# Altium project robotShield.PrjPcb
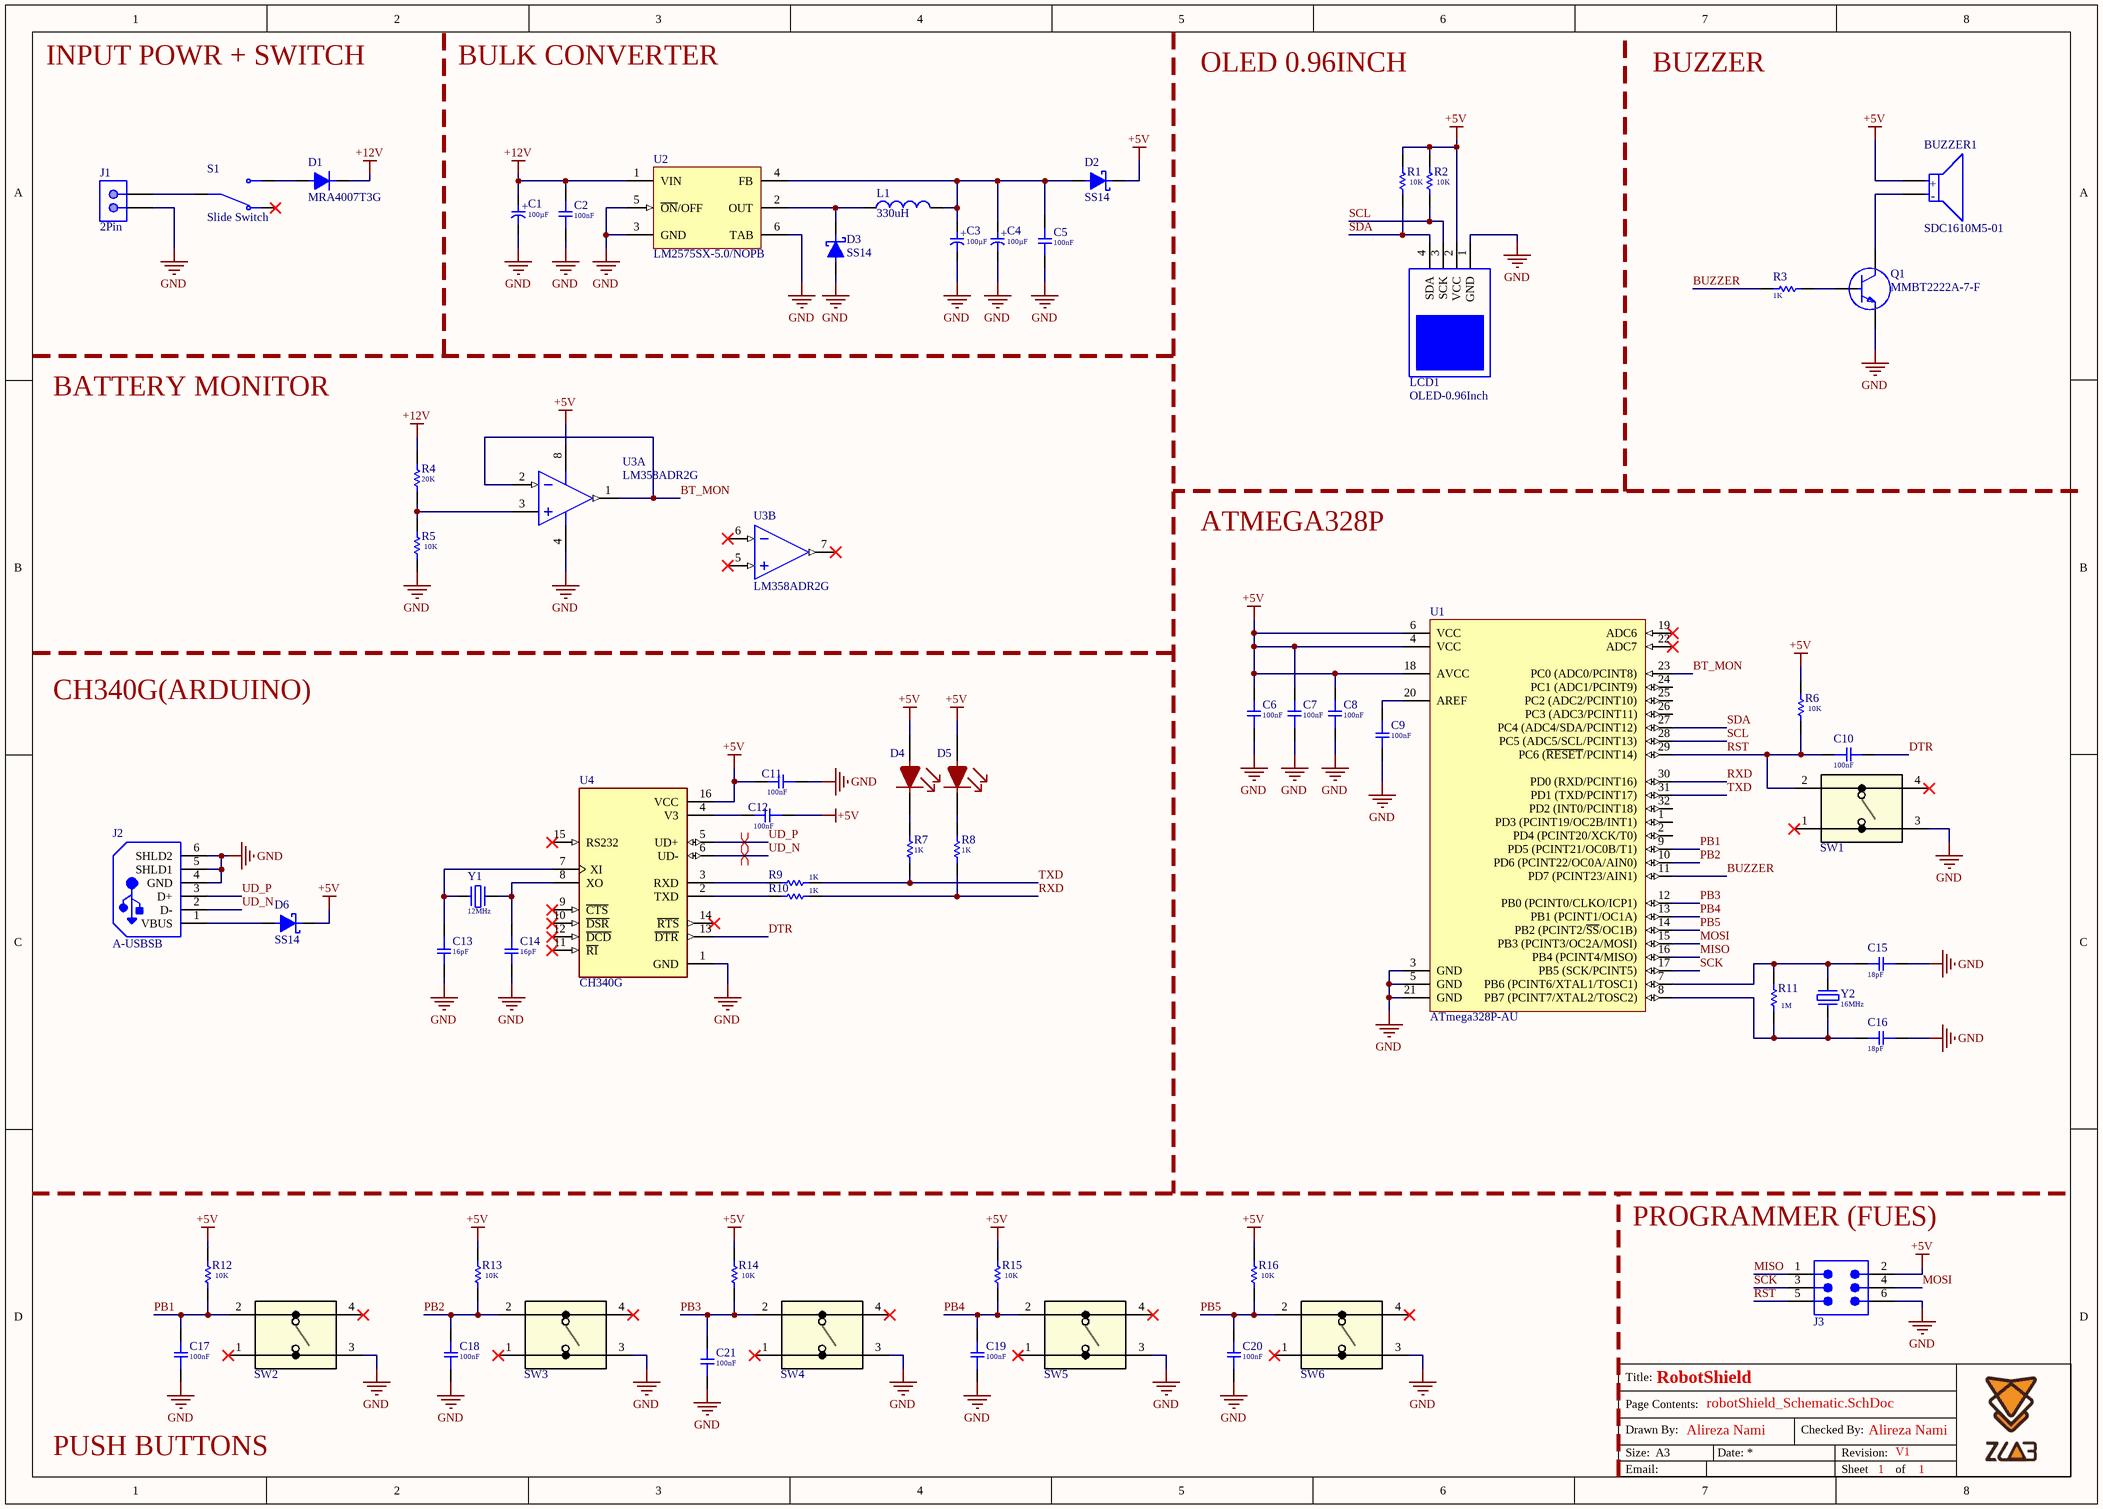
[diagram p0: robotShield_Schematic.SchDoc]
Project: RobotShield
1 sheet, 63 parts. Net scope: global (net labels, ports and power ports of the same name join across sheets).
Board file: robotShield_PCB.PcbDoc

## Sheet robotShield_Schematic.SchDoc
size A3; CheckedBy: Alireza Nami; DrawnBy: Alireza Nami; SheetNumber: 1; SheetTotal: 1; TotalSheet: 1; VersionRevision: V1

### Parts
BUZZER1  SDC1610M5-01  [BUZZER]
C1  Capacitance: 100µF  [CE-8x10mm]  (hidden comment: MAL215376101E3)
C2  Capacitance: 100nF  [C0603]  (hidden comment: CGA3E2X7R1H104K080AA)
C3  Capacitance: 100µF  [CE-8x10mm]  (hidden comment: MAL215376101E3)
C4  Capacitance: 100µF  [CE-8x10mm]  (hidden comment: MAL215376101E3)
C5  Capacitance: 100nF  [C0603]  (hidden comment: CGA3E2X7R1H104K080AA)
C6  Capacitance: 100nF  [C0603]  (hidden comment: CGA3E2X7R1H104K080AA)
C7  Capacitance: 100nF  [C0603]  (hidden comment: CGA3E2X7R1H104K080AA)
C8  Capacitance: 100nF  [C0603]  (hidden comment: CGA3E2X7R1H104K080AA)
C9  Capacitance: 100nF  [C0603]  (hidden comment: CGA3E2X7R1H104K080AA)
C10  Capacitance: 100nF  [C0603]  (hidden comment: CGA3E2X7R1H104K080AA)
C11  Capacitance: 100nF  [C0603]  (hidden comment: CGA3E2X7R1H104K080AA)
C12  Capacitance: 100nF  [C0603]  (hidden comment: CGA3E2X7R1H104K080AA)
C13  value 16pF  [C0603]  (hidden comment: C0603C160J3GACTU)
C14  value 16pF  [C0603]  (hidden comment: C0603C160J3GACTU)
C15  value 18pF  [C0603]  (hidden comment: C0603C180J3GACTU)
C16  value 18pF  [C0603]  (hidden comment: C0603C180J3GACTU)
C17  Capacitance: 100nF  [C0603]  (hidden comment: CGA3E2X7R1H104K080AA)
C18  Capacitance: 100nF  [C0603]  (hidden comment: CGA3E2X7R1H104K080AA)
C19  Capacitance: 100nF  [C0603]  (hidden comment: CGA3E2X7R1H104K080AA)
C20  Capacitance: 100nF  [C0603]  (hidden comment: CGA3E2X7R1H104K080AA)
C21  Capacitance: 100nF  [C0603]  (hidden comment: CGA3E2X7R1H104K080AA)
D1  MRA4007T3G  [SMA]
D2  SS14  [SMA]
D3  SS14  [SMA]
D4  SML-D12U1WT86  [LED_RED_0603]  (value not drawn)
D5  SML-D12U1WT86  [LED_RED_0603]  (value not drawn)
D6  SS14  [SMA]
J1  2Pin  [MOLX-2P-2.54MM]
J2  A-USBSB  [USBS-B]
J3  61200621621  [ICSP]  (value not drawn)
L1  value 330uH  [WE-PD_7332R]  (hidden comment: SRR0745A-331M)
LCD1  OLED-0.96Inch  [OLED]
Q1  MMBT2222A-7-F  [SOT23]
R1  value 10K  [R0603]  (hidden comment: RC0603JR-0710KL)
R2  value 10K  [R0603]  (hidden comment: RC0603JR-0710KL)
R3  Resistance: 1K  [R0603]  (hidden comment: RC0603JR-071KL)
R4  value 20K  [R0603]  (hidden comment: RC0603JR-0720KL)
R5  value 10K  [R0603]  (hidden comment: RC0603JR-0710KL)
R6  value 10K  [R0603]  (hidden comment: RC0603JR-0710KL)
R7  Resistance: 1K  [R0603]  (hidden comment: RC0603JR-071KL)
R8  Resistance: 1K  [R0603]  (hidden comment: RC0603JR-071KL)
R9  Resistance: 1K  [R0603]  (hidden comment: RC0603JR-071KL)
R10  Resistance: 1K  [R0603]  (hidden comment: RC0603JR-071KL)
R11  value 1M  [R0603]  (hidden comment: RC0603JR-071ML)
R12  value 10K  [R0603]  (hidden comment: RC0603JR-0710KL)
R13  value 10K  [R0603]  (hidden comment: RC0603JR-0710KL)
R14  value 10K  [R0603]  (hidden comment: RC0603JR-0710KL)
R15  value 10K  [R0603]  (hidden comment: RC0603JR-0710KL)
R16  value 10K  [R0603]  (hidden comment: RC0603JR-0710KL)
S1  Slide Switch  [SLIDE_SWITCH_RIGHT]
SW1  222AMVBAR  [TS_6x6x5]  (value not drawn)
SW2  222AMVBAR  [TS_6x6x5]  (value not drawn)
SW3  222AMVBAR  [TS_6x6x5]  (value not drawn)
SW4  222AMVBAR  [TS_6x6x5]  (value not drawn)
SW5  222AMVBAR  [TS_6x6x5]  (value not drawn)
SW6  222AMVBAR  [TS_6x6x5]  (value not drawn)
U1  ATmega328P-AU  [TQFP32]
U2  LM2575SX-5.0/NOPB  [DPAK-5]
U3  LM358ADR2G  [SOIC-8]  (parts A,B of 2)
U4  CH340G  [SOIC-16]
Y1  Frequency: 12MHz  [XTAL-SMD]  (hidden comment: LFXTAL003210BULK)
Y2  Frequency: 16MHz  [XTAL-SMD]  (hidden comment: ABLS-16.000MHZ-K4T)

### Nets
+5V: BUZZER1.2(A) C6.1 C7.1 C8.1 C11.1 C12.2 D2.1(C) D4.2(A) D5.2(A) D6.1(C) J3.2 LCD1.2(VCC) R1.2 R2.2 R6.2 R12.2 R13.2 R14.2 R15.2 R16.2 U1.4(VCC) U1.6(VCC) U1.18(AVCC) U3.8 U4.16(VCC)
+12V: C1.2(A) C2.1 D1.1(K) R4.2 U2.1(VIN)
GND: C1.1(C) C2.2 C3.1(C) C4.1(C) C5.2 C6.2 C7.2 C8.2 C9.1 C11.2 C13.1 C14.1 C15.2 C16.2 C17.2 C18.2 C19.2 C20.2 C21.2 D3.2(A) J1.1 J2.4(GND) J2.5(SHLD1) J2.6(SHLD2) J3.6 LCD1.1(GND) Q1.2(E) R5.1 SW1.3 SW2.3 SW3.3 SW4.3 SW5.3 SW6.3 U1.3(GND) U1.5(GND) U1.21(GND) U2.3(GND) U2.5(~{ON}/OFF) U2.6(TAB) U3.4 U4.1(GND)
BT_MON: U1.23(PC0_(ADC0/PCINT8)) U3.1(OUTA) U3.2(INA-)
BUZZER: R3.2 U1.11(PD7_(PCINT23/AIN1))
DTR: C10.1 U4.13(~{DTR})
MISO: J3.1 U1.16(PB4_(PCINT4/MISO))
MOSI: J3.4 U1.15(PB3_(PCINT3/OC2A/MOSI))
PB1: C17.1 R12.1 SW2.2 U1.9(PD5_(PCINT21/OC0B/T1))
PB2: C18.1 R13.1 SW3.2 U1.10(PD6_(PCINT22/OC0A/AIN0))
PB3: C21.1 R14.1 SW4.2 U1.12(PB0_(PCINT0/CLKO/ICP1))
PB4: C19.1 R15.1 SW5.2 U1.13(PB1_(PCINT1/OC1A))
PB5: C20.1 R16.1 SW6.2 U1.14(PB2_(PCINT2/~{SS}/OC1B))
RST: C10.2 J3.5 R6.1 SW1.2 U1.29(PC6_(~{RESET}/PCINT14))
RXD: R8.1 R10.2 U1.30(PD0_(RXD/PCINT16))
SCK: J3.3 U1.17(PB5_(SCK/PCINT5))
SCL: LCD1.3(SCK) R2.1 U1.28(PC5_(ADC5/SCL/PCINT13))
SDA: LCD1.4(SDA) R1.1 U1.27(PC4_(ADC4/SDA/PCINT12))
TXD: R7.1 R9.2 U1.31(PD1_(TXD/PCINT17))
UD_N: J2.2(D-) U4.6(UD-)
UD_P: J2.3(D+) U4.5(UD+)
NetBUZZER1_1: BUZZER1.1(C) Q1.3(C)
NetC3_2: C3.2(A) C4.2(A) C5.1 D2.2(A) L1.2 U2.4(FB)
NetC9_2: C9.2 U1.20(AREF)
NetC12_1: C12.1 U4.4(V3)
NetC13_2: C13.2 U4.7(XI) Y1.1
NetC14_2: C14.2 U4.8(XO) Y1.2
NetC15_1: C15.1 R11.2 U1.7(PB6_(PCINT6/XTAL1/TOSC1)) Y2.2
NetC16_1: C16.1 R11.1 U1.8(PB7_(PCINT7/XTAL2/TOSC2)) Y2.1
NetD1_2: D1.2(A) S1.3
NetD3_1: D3.1(C) L1.1 U2.2(OUT)
NetD4_1: D4.1(C) R7.2
NetD5_1: D5.1(C) R8.2
NetD6_2: D6.2(A) J2.1(VBUS)
NetJ1_2: J1.2 S1.2
NetQ1_1: Q1.1(B) R3.1
NetR4_1: R4.1 R5.2 U3.3(INA+)
NetR9_1: R9.1 U4.3(RXD)
NetR10_1: R10.1 U4.2(TXD)

Not connected (* = marked no-connect by the designer): S1 1*; SW1 1* 4*; SW2 1* 4*; SW3 1* 4*; SW4 1* 4*; SW5 1* 4*; SW6 1* 4*; U1 1(PD3_(PCINT19/OC2B/INT1)) 2(PD4_(PCINT20/XCK/T0)) 19(ADC6)* 22(ADC7)* 24(PC1_(ADC1/PCINT9)) 25(PC2_(ADC2/PCINT10)) 26(PC3_(ADC3/PCINT11)) 32(PD2_(INT0/PCINT18)); U3 5(INB+)* 6(INB-)* 7(OUTB)*; U4 9(~{CTS})* 10(~{DSR})* 11(~{RI})* 12(~{DCD})* 14(~{RTS})* 15(RS232)*

### Layout directives
differential pair: UD_N, UD_P

### Notes on the sheet
- INPUT POWR + SWITCH
- BULK CONVERTER
- OLED 0.96INCH
- BUZZER
- BATTERY MONITOR
- ATMEGA328P
- CH340G(ARDUINO)
- (near J3) PROGRAMMER (FUES)
- PUSH BUTTONS
- Title:
- Size:
- Drawn By:
- Email:
- Page Contents:
- A3
- Date:
- Checked By:
- Revision:
- Sheet
- of
- (in symbol BUZZER-5V) +; -
- (in symbol CE-100uF-25V) +

### Library data of the parts
BUZZER1 = BUZZER-5V: AUDIO MAGNETIC INDICATOR 4-8V TH; Nominal Supply Voltage (DC): 5V; Input Type: DC; Max Supply Current: 30mA; Number of Terminals/Pins: 2; Frequency: 2.4kHz; Lead Free: Lead Free; Operating Supply Current: 30mA; Sensing Method: Magnetic; Termination: PC Pins; Number of Pins: 2; Mount: Through Hole; Min Operating Temperature: -10°C; Diameter: 16mm; Series: SDC; Max Operating Temperature: 70°C; Packaging: Tray; Voltage Rating: 5V; Height: 10mm
C1 C3 C4 = CE-100uF-25V: MAL215376101E3 Cap Aluminum 100uF 25V 20% (8 X 10mm) SMD 0.5 Ohm 180mA 3000h 105C Blister T/R; NexarPartId: 42636023; Polarity: Polar; Dissipation Factor: 16%; Dielectric Material: Aluminium; Life (Hours): 2000hours; ESR (Equivalent Series Resistance): 500mΩ; Leakage Current: 22µA; Mount: Surface Mount; Voltage: 25V; Min Operating Temperature: -55°C; Max Operating Temperature: 105°C; Termination: SMD/SMT; Diameter: 8mm; Tolerance: 20%; Lead Free: Lead Free; Ripple Current (AC): 180mA; Ripple Current: 180mA; Height - Seated (Max): 10.4902mm; Voltage Rating: 25V; REACH SVHC: Unknown; Number of Pins: 2; Width: 8.6mm; Radiation Hardening: No; Height: 10mm; Voltage Rating (AC): 25V; Voltage Rating (DC): 25V; Case/Package: Radial; Schedule B: 8532220020, 8532220020|8532220020, 8532220020|8532220020|8532220020, 8532220020|8532220020|8532220020|8532220020; RoHS: Compliant; Packaging: Cut Tape
C2 C5-C12 C17-C21 = 100N-50V-X7R-0603: Cap Ceramic 100nF 50V X7R 10% Pad SMD 0603 +125°C Automotive T/R; Weight: 7.1E-05oz; Composition: Ceramic; Max Operating Temperature: 125°C; Termination: SMD/SMT; Dielectric: X7R; Length: 1.6mm; Package Quantity: 1; REACH SVHC: No SVHC; Lead Free: Lead Free; Case Code (Metric): 1608; Min Operating Temperature: -55°C; Packaging: Tape and Reel; Tolerance: 10%; Voltage Rating: 50V; Case Code (Imperial): 0603; Case/Package: 0603; Voltage Rating (DC): 50V; Depth: 0.8mm; Radiation Hardening: No; Ratings: AEC-Q200; Mount: Surface Mount; Voltage: 50V; Thickness: 0.035inch; Width: 0.8mm; Height: 0.8mm
C13 C14 = 16P-25V-C0G-0603: 16 pF ±5% 25V Ceramic Capacitor C0G, NP0 0603 (1608 Metric); Manufacturer: KEMET; Supplier: Digikey; Supplier Part Number: 399-C0603C160J3GACTUTR-ND; Manufacturer Part Number: C0603C160J3GACTU; RoHS: No; Pricing: 4000=0.05638 (USD)
C15 C16 = 18P-25V-C0G-0603: 0603 (1608METRIC) Ceramic Capacitor SMD Comm C0G 25V 18PF ±5% C0G NP0; Manufacturer: KEMET; Temperature Coefficient: 30ppm/°C; Supplier Part Number: 80-C0603C180J3G; Manufacturer Part Number: C0603C180J3GACTU; RoHS: Yes; Category: Ceramic Capacitors; Stock: 8329; Pricing: 1=0.23, 10=0.131, 50=0.131, 100=0.078, 1000=0.053, 10000=0.039 (USD); Mounting Technology: Surface Mount; Case/Package: 0603; Case Code (Imperial): 0603; Case Code (Metric): 1608; Dielectric Material: Ceramic; Material: Ceramic; Min Operating Temperature: -55°C; Max Operating Temperature: 125°C; Tolerance: 5%; Voltage Rating: 25V; Packaging: Tape and Reel; Package Quantity: 4000; Voltage Rating (DC): 25V; Dielectric: C0G; Termination: SMD/SMT; Series: C; Construction: Flat; Length: 1.6mm; Width: 0.031inch; Height: 0.8mm; Lead Pitch: 0.7mm; Thickness: 0.034inch; Depth: 0.8mm; Radiation Hardening: No; Reach SVHC Compliant: No; Lead Free: Lead Free; RoHS Compliant: Yes; ComponentLink1URL: https://datasheet.ciiva.com/23984/1723858-23984097.pdf?src-supplier=Newark; ComponentLink1Description: https://datasheet.ciiva.com/23984/1723858-23984097.pdf?src-supplier=Newark; ComponentLink2URL: https://datasheet.ciiva.com/22752/1907778-22752151.pdf?src-supplier=Element14; ComponentLink2Description: https://datasheet.ciiva.com/22752/1907778-22752151.pdf?src-supplier=Element14; ComponentLink3URL: https://datasheet.ciiva.com/28453/1907778-28453241.pdf?src-supplier=Element14; ComponentLink3Description: https://datasheet.ciiva.com/28453/1907778-28453241.pdf?src-supplier=Element14; ComponentLink4URL: https://datasheet.ciiva.com/5421/kem-c1003-c0g-smd-5421693.pdf?src-supplier=Mouser; ComponentLink4Description: https://datasheet.ciiva.com/5421/kem-c1003-c0g-smd-5421693.pdf?src-supplier=Mouser; Supplier: Mouser
D1 = M7: Surface Mount Standard Recovery Power Rectifier, 2-Pin SMA, Pb-Free, Tape and Reel; Manufacturer: On Semiconductor; IFSM Max (A): 30; IO(rec) Max (A): 1; VRRM Max (V): 1000; RoHS: TRUE; PackageReference: SMA-2-403D-02; ComponentLink2Description: Datasheet; PackageVersion: Rev. G, 07/2012; Packing: Tape and Reel; ComponentLink3Description: Package Specification; DatasheetVersion: Rev. 9; Type: Standard Recovery; ComponentLink1Description: Manufacturer URL; PackageDescription: 2-Pin Small Molded Package, J-Bend Lead, Body 2.605 x 4.315 mm; PartNumber: MRA4007T3G; ComponentLink3URL: http://www.onsemi.com/pub_link/Collateral/403D-02.PDF; ComponentLink2URL: http://www.onsemi.com/pub_link/Collateral/MRA4003T3-D.PDF; ComponentLink1URL: http://www.onsemi.com/; Mounting Technology: Surface Mount
D2 D3 D6 = SS14: DIODE SCHOTTKY 40V 1A DO214AC; Manufacturer: Vishay; Manufacturer Part Number: SS14-E3/61T; Peak Reverse Current: 0.2mA; Standoff Height: 0mm; Max Junction Temp: +150°C; Max Surge Forward Current: 40A; RoHS: TRUE; Digikey Description: DIODE SCHOTTKY 40V 1A DO214AC; Category: Diode; Device Class L3: Schottky Diodes; Temperature Range High: +150°C; Automotive: No; Temperature: -65°C to +150°C; Device Class L2: Diodes; Forward Current: 1A; Temperature Range Low: -65°C; Footprint Url: http://www.vishay.com/docs/95400/sma.pdf; Octopart: https://octopart.com/ss14-e3%2F61t-vishay-39552847; Package: 95400; Max Repetitive Reverse Voltage: 40V; ComponentLink2Description: Datasheet; ComponentLink2URL: http://www.vishay.com/docs/88746/ss12.pdf; Lead Free: Yes; Height: 2.29mm; Mouser Description: SS14 Series 40 V 1 A Surface Mount Schottky Barrier Rectifier - DO-214AC (SMA); Device Class L1: Discrete Semiconductors
D4 D5 = LED_RED_0603: LED RED DIFFUSED 1608 SMD; Manufacturer: Rohm; Led Orientation: Top View; Power Dissipation: 54mW; Forward Current: 20mA; Wavelength: 620nm; Reverse Voltage: 5V; Luminous Intensity: 63mcd; Forward Voltage: 2.2V; Mouser Description: SML-D12 Series Red 0603 Diffused 63 mcd 2.2 V Surface Mount LED; Temperature: -40°C to +85°C; Device Class L2: LEDs; Lead Free: Yes; Automotive: No; Octopart: https://octopart.com/sml-d12u1wt86-rohm-70850259; RoHS: TRUE; Colour: Red; Digikey Description: LED RED DIFFUSED 1608 SMD; Package: SML-D12; Device Class L1: Optoelectronics; Category: Diode; Temperature Range High: +85°C; Height: 0.65mm; ComponentLink2Description: Datasheet; Temperature Range Low: -40°C; ComponentLink2URL: https://www.rohm.com/datasheet/SML-D12U1W/sml-d12x1-e; Manufacturer Part Number: SML-D12U1WT86; Device Class L3: unset
J1 = Header_2P_2.54mm: Male Header, Pitch 2.54 mm, 1 x 2 Position, Height 10.67 mm, Tail Length 3.56 mm, 0 to 75 degC, RoHS, Bulk; Package Quantity: 3000; Height: 10.67 mm; RoHSCompliant: True; ComponentLink2URL: https://datasheet.ciiva.com/19454/232266-19454304.pdf; PartNumber: 22-23-2021; Packaging: Bulk; ComponentLink2Description: Datasheet; Min Operating Temperature: 0 degC; ComponentLink1Description: Manufacturer URL; Length: 5.08 mm; Mounting Technology: Through Hole; Max Operating Temperature: 75 degC; REACH SVHC: Unknown; PackageDescription: Male Header, Pitch 2.54 mm, 1 x 2 Position, Height 10.67 mm, Tail Length 3.56 mm; ComponentLink1URL: http://www.molex.com/; Mount: Through Hole; Radiation Hardening: No; Width: 6.35 mm; Pins: 2
J2 = A-USBSB: Connector Receptacle, USB Type B, Right Angle, -20 to 85 degC, 4-Pin THD, RoHS, Tray; Manufacturer: ASSMANN WSW; Gender: Female; CAD Drawing: 3DCADModel; Number of Ports: 1; Mounting Type: ThroughHole; Datasheet URL: https://datasheet.ciiva.com/11731/0900766b80da421f-11731321.pdf; Datasheet Version: 12/2009; Manufacturer URL: http://www.assmann.us/; Package Description: 4-Pin Through Hole Device, Body 16.5 x 12.04 mm; Body Orientation: RightAngle; Mounting Technology: ThroughHole; Package Reference: USBSB; Termination Method: Solder
J3 = ICSP: CONN HEADER VERT 6POS 2.54MM; NexarPartId: 32855456; Number of Positions: 6; Gender: Male; Connector Type: Male Pin; Insulation Resistance: 1GΩ; Contact Resistance: 20mΩ; Operating Supply Voltage: 250V; Current Rating: 3A; Termination: Solder; RoHS: Compliant; Length: 15.28mm; Contact Material: Copper; Number of Pins: 6; Min Operating Temperature: -40°C; Number of Contacts: 6; Pitch: 2.54mm; Number of Rows: 2; Contact Plating: Gold; Color: Black; Mount: Through Hole; Lead Pitch: 2.54mm; Insulation Material: PBT; REACH SVHC: Unknown; Row Spacing: 2.54mm; Orientation: Vertical; Max Operating Temperature: 105°C
L1 = 330uH-0.34A: Inductor Power Shielded Wirewound 330uH 20% 1KHz Ferrite 0.34A 1.5Ohm DCR Automotive T/R; Manufacturer: Bourns; Current Rating: 340mA; Saturation Current: 400mA; DC Resistance (DCR): 1.5R; Supplier: Digikey; Supplier Part Number: SRR0745A-331MCT-ND; Manufacturer Part Number: SRR0745A-331M; RoHS: No; Category: Fixed Inductors; Stock: 3891; Pricing: 1=0.8, 10=0.66, 25=0.6108, 50=0.576, 100=0.543, 250=0.50232, 500=0.47364 (USD); Mounting Technology: Surface Mount; Case/Package: Nonstandard; Core Material: Ferrite; Min Operating Temperature: -40°C; Max Operating Temperature: 125°C; Tolerance: 20%; Inductance Tolerance: 20%; Packaging: Tape and Reel; Shielding: Shielded; Test Frequency: 1kHz; RMS Current (Irms): 340mA; Termination: SMD/SMT; Series: SRR0745A; Length: 0.287inch; Width: 0.287inch; Height - Seated (Max): 0.185inch; Ratings: AEC-Q200; Reach SVHC Compliant: No; ComponentLink1URL: https://datasheet.ciiva.com/46451/1865600-46451113.pdf?src-supplier=Element14; ComponentLink1Description: https://datasheet.ciiva.com/46451/1865600-46451113.pdf?src-supplier=Element14; ComponentLink2URL: https://datasheet.ciiva.com/48955/70480969-48955818.pdf?src-supplier=Allied+Electronics; ComponentLink2Description: https://datasheet.ciiva.com/48955/70480969-48955818.pdf?src-supplier=Allied+Electronics
LCD1 = OLED-0.96Inch: Monochrome 0.96 128x64 OLED graphic display | Adafruit Industries 326; Manufacturer Part Number: 326; Resolution (height): 64pixel; Resolution (width): 128pixel; Interface: I2C,SPI; Background Color: Black; Supplier: Digikey; Supplier Part Number: 1528-1220-ND; Manufacturer: Adafruit Industries; RoHS: Yes; Category: LCD, OLED, Graphic Displays; Stock: 284; Pricing: 1=17.5 (USD); Case/Package: Module; Series: -; Diagonal Size: 0.96inch; ComponentLink1URL: https://datasheet.ciiva.com/6967/1718446-6967825.pdf?src-supplier=Newark; ComponentLink1Description: https://datasheet.ciiva.com/6967/1718446-6967825.pdf?src-supplier=Newark; ComponentLink2URL: https://datasheet.ciiva.com/39121/2211952-39121704.pdf?src-supplier=Jameco; ComponentLink2Description: https://datasheet.ciiva.com/39121/2211952-39121704.pdf?src-supplier=Jameco
Q1 = MMBT2222A: TRANS NPN 40V 0.6A SMD SOT23-3; Number of Elements: 1; Frequency: 300MHz; Max Collector Current: 600mA; Collector Base Voltage (VCBO): 75V; Current: 1A; Element Configuration: Single; Power Dissipation: 350mW; hFE Min: 100; Collector Emitter Saturation Voltage: 1V; Max Power Dissipation: 300mW; Emitter Base Voltage (VEBO): 6V; Voltage: 40V; Collector Emitter Breakdown Voltage: 40V; Width: 1.4mm; Polarity: NPN; Termination: SMD/SMT; Max Operating Temperature: 150°C; Transition Frequency: 300MHz; Contact Plating: Tin; Mount: Surface Mount; Max Frequency: 300MHz; Case/Package: SOT-23; Gain Bandwidth Product: 300MHz; Lead Free: Lead Free; Collector Emitter Voltage (VCEO): 40V; Radiation Hardening: No; Voltage Rating (DC): 40V; Height: 1mm; Max Breakdown Voltage: 40V; Packaging: Tape and Reel; Length: 3.05mm; Min Operating Temperature: -55°C; Weight: 0.000282oz; Current Rating: 600mA; REACH SVHC: No SVHC; Package Quantity: 3000; Continuous Collector Current: 600mA; Number of Pins: 3
R1 R2 R5 R6 R12-R16 = 10K-5%-0603: 100Mw Thick Film Resistors 100Ppm/ 5% 10K 0603 Chip Resistor Surface Mount Rohs; Manufacturer: Yageo; Temperature Coefficient: 100ppm/°C; Voltage Rating (AC): 50V; Supplier: Future Electronics; Supplier Part Number: 7356926; Manufacturer Part Number: RC0603JR-0710KL; RoHS: Yes; Category: Chip SMD Resistors; Stock: 1475000; Pricing: 5000=0.0009, 25000=0.0009, 100000=0.0008, 200000=0.0008, 500000=0.0008 (USD); Case/Package: 0603; Min Operating Temperature: -55°C; Max Operating Temperature: 155°C; Tolerance: 5%; Max Power Dissipation: 100mW; Number of Terminations: 2; Series: RC; Lead Free: Lead Free; Reach SVHC Compliant: Unknown; RoHS Compliant: Yes; ComponentLink1URL: https://datasheet.ciiva.com/2452/pyu-rc-group-51-rohs-l-10-2452848.pdf?src-supplier=Digikey; ComponentLink1Description: https://datasheet.ciiva.com/2452/pyu-rc-group-51-rohs-l-10-2452848.pdf?src-supplier=Digikey
R3 R7-R10 = 1K-5%-0603: Chip Resistor, 1 KOhm, +/- 5%, 0.063 W, -55 to 155 degC, 0603 (1608 Metric), RoHS, Tape and Reel; Manufacturer: Yageo; Resistor Case Style: 0603[1608Metric]; Resistor Element Type: ThickFilm; Product Range: RCSeries; SVHC: ToBeAdvised; Voltage Rating: 50V; Temperature Coefficient: ±100ppm/degC; Power Rating: 100mW; Packaging: CutTape; Manufacturer URL: http://www.yageo.com/; Resistance Tolerance: ±5%; Datasheet Version: Rev. 4, 04/2009; MSL: MSL1-Unlimited; Package Description: 2-Pin Surface Mount Device, Body 1.6 x 0.8 mm; Automotive Qualification Standard: -; Package Reference: 603; Datasheet URL: https://datasheet.ciiva.com/2452/pyu-rc0603-51-rohs-l-4-2452848.pdf
R4 = 20K-5%-0603: Res Thick Film 0603 20K Ohm 5% 0.1W(1/10W) ±100ppm/C Pad SMD T/R; Manufacturer: Yageo; Temperature Coefficient: 100ppm/°C; Power Rating: 100mW; Voltage Rating (DC): 50V; Supplier: Arrow Electronics; Supplier Part Number: RC0603JR-0720KL; Manufacturer Part Number: RC0603JR-0720KL; RoHS: Yes; Category: Chip SMD Resistors; Stock: 90000; Pricing: 5000=0.0009 (USD); Case/Package: 0603; Pins: 2; Case Code (Metric): 1608; Case Code (Imperial): 0603; Min Operating Temperature: -55°C; Max Operating Temperature: 155°C; Packaging: Tape and Reel; Tolerance: 5%; Resistor Type: Thick Film; Number of Terminations: 2; Termination: SMD/SMT; Max Power Dissipation: 100mW; Features: Moisture Resistant; Voltage Rating: 50V; Package Quantity: 1; Series: RC; Resistance Tolerance: 5%; Length: 0.063inch; Width: 0.031inch; Height: 0.022inch; Lead Free: Lead Free; Reach SVHC Compliant: No; RoHS Compliant: Yes; ComponentLink1URL: https://datasheet.ciiva.com/2453/pyu-r-int-thick-7-2453163.pdf?src-supplier=Digikey; ComponentLink1Description: https://datasheet.ciiva.com/2453/pyu-r-int-thick-7-2453163.pdf?src-supplier=Digikey; ComponentLink2URL: https://datasheet.ciiva.com/2453/pyu-r-int-thick-7-2453164.pdf?src-supplier=Digikey; ComponentLink2Description: https://datasheet.ciiva.com/2453/pyu-r-int-thick-7-2453164.pdf?src-supplier=Digikey; ComponentLink3URL: https://datasheet.ciiva.com/2453/pyu-r-int-thick-7-2453165.pdf?src-supplier=Digikey; ComponentLink3Description: https://datasheet.ciiva.com/2453/pyu-r-int-thick-7-2453165.pdf?src-supplier=Digikey; ComponentLink4URL: https://datasheet.ciiva.com/46394/443971-46394997.pdf?src-supplier=Element14; ComponentLink4Description: https://datasheet.ciiva.com/46394/443971-46394997.pdf?src-supplier=Element14
R11 = 1M-5%-0603: 100Mw Thick Film Resistors 100Ppm/ 5% 1M 0603 Chip Resistor Surface Mount Rohs; Manufacturer: Yageo; Voltage Rating (DC): 50V; Temperature Coefficient: 100ppm/°C; Supplier: Avnet; Supplier Part Number: RC0603JR-071ML; Manufacturer Part Number: RC0603JR-071ML; RoHS: Yes; Category: Chip SMD Resistors; Stock: 1030000; Pricing: 5000=0.00088, 10000=0.00087, 20000=0.00086, 30000=0.00084, 40000=0.00083 (USD); Case/Package: 0603; Pins: 2; Contact Plating: Tin,Matte; Case Code (Imperial): 0603; Case Code (Metric): 1608; Min Operating Temperature: -55°C; Max Operating Temperature: 155°C; Tolerance: 5%; Packaging: Tape and Reel; Power Rating: 100mW; Voltage Rating: 50V; Termination: SMD/SMT; Features: Moisture Resistant; Series: RC; Max Power Dissipation: 100mW; Number of Terminations: 2; Package Quantity: 5000; Resistor Type: Thick Film; Resistance Tolerance: 5%; Construction: Rectangular; Voltage Rating (AC): 50V; Length: 1.6mm; Width: 0.8mm; Height: 0.45mm; Depth: 0.8mm; Lead Free: 5697LeadFree; RoHS Compliant: Yes; Reach SVHC Compliant: No; Military Standard: Not; ComponentLink1URL: https://datasheet.ciiva.com/46395/443971-46395067.pdf?src-supplier=Element14; ComponentLink1Description: https://datasheet.ciiva.com/46395/443971-46395067.pdf?src-supplier=Element14; ComponentLink2URL: https://datasheet.ciiva.com/7746/443971-7746463.pdf?src-supplier=Element14; ComponentLink2Description: https://datasheet.ciiva.com/7746/443971-7746463.pdf?src-supplier=Element14; ComponentLink3URL: https://datasheet.ciiva.com/12555/rc0603-272842-12555342.pdf?src-supplier=Mouser; ComponentLink3Description: https://datasheet.ciiva.com/12555/rc0603-272842-12555342.pdf?src-supplier=Mouser; ComponentLink4URL: https://datasheet.ciiva.com/8883/pyu-rc0603-51-rohs-l-4-8883053.pdf?src-supplier=Avnet; ComponentLink4Description: https://datasheet.ciiva.com/8883/pyu-rc0603-51-rohs-l-4-8883053.pdf?src-supplier=Avnet
S1 = SPDT: Slide Switch SPDT Through Hole, Right Angle; MF: TE Connectivity; MP: STS121RA04; SnapEDA_Link: https://www.snapeda.com/parts/STS121RA04/TE+Connectivity+ALCOSWITCH+Switches/view-part/?ref=snap; Package: None; Value: *; Check_prices: https://www.snapeda.com/parts/STS121RA04/TE+Connectivity+ALCOSWITCH+Switches/view-part/?ref=eda
SW1-SW6 = TactileSwitch_6x6x5: SWITCH TACTILE SPST-NO 0.05A 12V; Manufacturer_Name: CTS Components; Type: Tactile Switches; Copyright: Copyright (C) 2025 Ultra Librarian. All rights reserved.; Manufacturer_Part_Number: 222AMVBAR; RefDes: RefDes
U1 = ATmega328P-AU: 8-bit AVR Microcontroller, 32KB Flash, 1KB EEPROM, 2KB SRAM, 32-pin TQFP, Industrial Grade (-40°C to 85°C); PackageDescription: 32-Lead, 7x7x1.0 mm Body, 0.8mm Lead Pitch, Thin Profile Plastic Quad Flat Package (TQFP); DatasheetVersion: revD, May-2011; RevisionNote: DatasheetVersion & PackageVersion updated. URLs added.; ComponentLink1URL: http://www.atmel.com/; ComponentLink2Description: ATmega48A/48PA/88A/88PA/168A/168PA/328/328P Datasheet; Code_JEDEC: MS-026-ABA; ComponentLink1Description: Manufacturer URL; PackageReference: 32A; ComponentLink3Description: ATmega48A/48PA/88A/88PA/168A/168PA/328/328P Summary; ComponentLink2URL: http://www.atmel.com/dyn/resources/prod_documents/doc8271.pdf; PackageVersion: revC, Oct-2010; ComponentLink3URL: http://www.atmel.com/dyn/resources/prod_documents/8271S.pdf
U2 = LM2575-5.0V: SIMPLE SWITCHER® 1A Step-Down Voltage Regulator, 5-pin TO-263, Pb-Free; Manufacturer: Texas Instruments; PackageTopMarking: NSUZXYTTE#*LM2575S*-5.0 P+; PowerWise: N; PinCount: 5; RoHS: Y; PackageDescription: TO-263, Molded, .400 x .390 x .180in, 5 Lead, .067in Pitch, Surface Mount; Code_JEDEC: MO-169-AB; ComponentLink1URL: http://www.ti.com/general/docs/lit/getliterature.tsp?genericPartNumber=LM2575-N&fileType=pdf; PackageReference: KTT0005B; ComponentLink1Description: Datasheet URL; CompType: Switcher
U3 = LM358: Single Supply Dual Operational Amplifier, 3 to 32 V, 0 to 70 degC, 8-Pin SOIC, Pb-Free, Tape and Reel; Manufacturer: On Semiconductor; VCC Min (V): 3; VCC Max (V): 32; DatasheetVersion: Rev. 27; ComponentLink1URL: http://www.onsemi.com/; PackageVersion: Rev. AK, 02/2011; Packing: Tape and Reel; ComponentLink3URL: http://www.onsemi.com/pub_link/Collateral/751-07.PDF; ComponentLink2URL: http://www.onsemi.cn/pub_link/Collateral/LM358-D.PDF; Mounting Technology: Surface Mount; PackageReference: SOIC-8-751-07; PackageDescription: 8-Pin Small Outline Integrated Circuit, Body 4.9 x 3.9 mm, Pitch 1.27 mm; ComponentLink3Description: Package Specification; ComponentLink2Description: Datasheet; RoHS: TRUE; ComponentLink1Description: Manufacturer URL; PartNumber: LM358ADR2G
U4 = CH340G: USB Interface Integrated Circuit; MF: WCH; Value: *; SnapEDA_Link: https://www.snapeda.com/parts/Ch340G/WCH/view-part/?ref=snap; MP: Ch340G; Check_prices: https://www.snapeda.com/parts/Ch340G/WCH/view-part/?ref=eda; Availability: Not in stock; Price: None; Package: None
Y1 = CRYSTAL-12MHZ: CRYSTAL 12.0MHZ 16PF SMD; Manufacturer: IQD Frequency Products; Esr: 40Ω; Stability: 50ppm; Tolerance: 30ppm; Lead Free: Yes; Device Class L2: Crystals / Oscillators; Manufacturer Part Number: LFXTAL003210BULK; Height: 4.3mm; Temperature Range Low: -10°C; Category: Crys; Temperature: -10°C to +60°C; Series: HC49/4HSMX; Automotive: No; Temperature Range High: +60°C; Package: LFXTAL003210BULK; ComponentLink2URL: https://www.iqdfrequencyproducts.com/products/pn/LFXTAL003210Bulk.pdf; Device Class L1: Passive Components; Digikey Description: CRYSTAL 12.0MHZ 16PF SMD; Octopart: https://octopart.com/lfxtal003210bulk-iqd+frequency+products-20904063; RoHS: TRUE; Load Capacitance: 16pF; ComponentLink2Description: Datasheet; Device Class L3: Crystals
Y2 = CRYSTAL-16MHZ: CRYSTAL 16.0000MHZ 18PF SMD; Manufacturer: Abracon; Stability: 50ppm; Tolerance: 30ppm; Standoff Height: 0mm; Esr: 40Ω; ComponentLink2URL: https://abracon.com/Resonators/abls.pdf; Temperature Range High: +125°C; Package: ABLS; Device Class L3: Crystals; Temperature: -40°C to +125°C; Load Capacitance: 18pF; Device Class L2: Crystals / Oscillators; Mouser Description: Crystal 16MHz ±30ppm (Tol) ±50ppm (Stability) 18pF FUND 40Ohm 2-Pin HC-49/US SMD T/R; Category: Crys; ComponentLink2Description: Datasheet; Manufacturer Part Number: ABLS-16.000MHZ-K4T; Series: ABLS; Automotive: No; Octopart: https://octopart.com/abls-16.000mhz-k4t-abracon-18618626; RoHS: TRUE; Digikey Description: CRYSTAL 16.0000MHZ 18PF SMD; Temperature Range Low: -40°C; Lead Free: Yes; Height: 4.3mm; Device Class L1: Passive Components